# Altium schematic sheet schem.SchDoc
size A; SheetNumber: 1; SheetTotal: 1
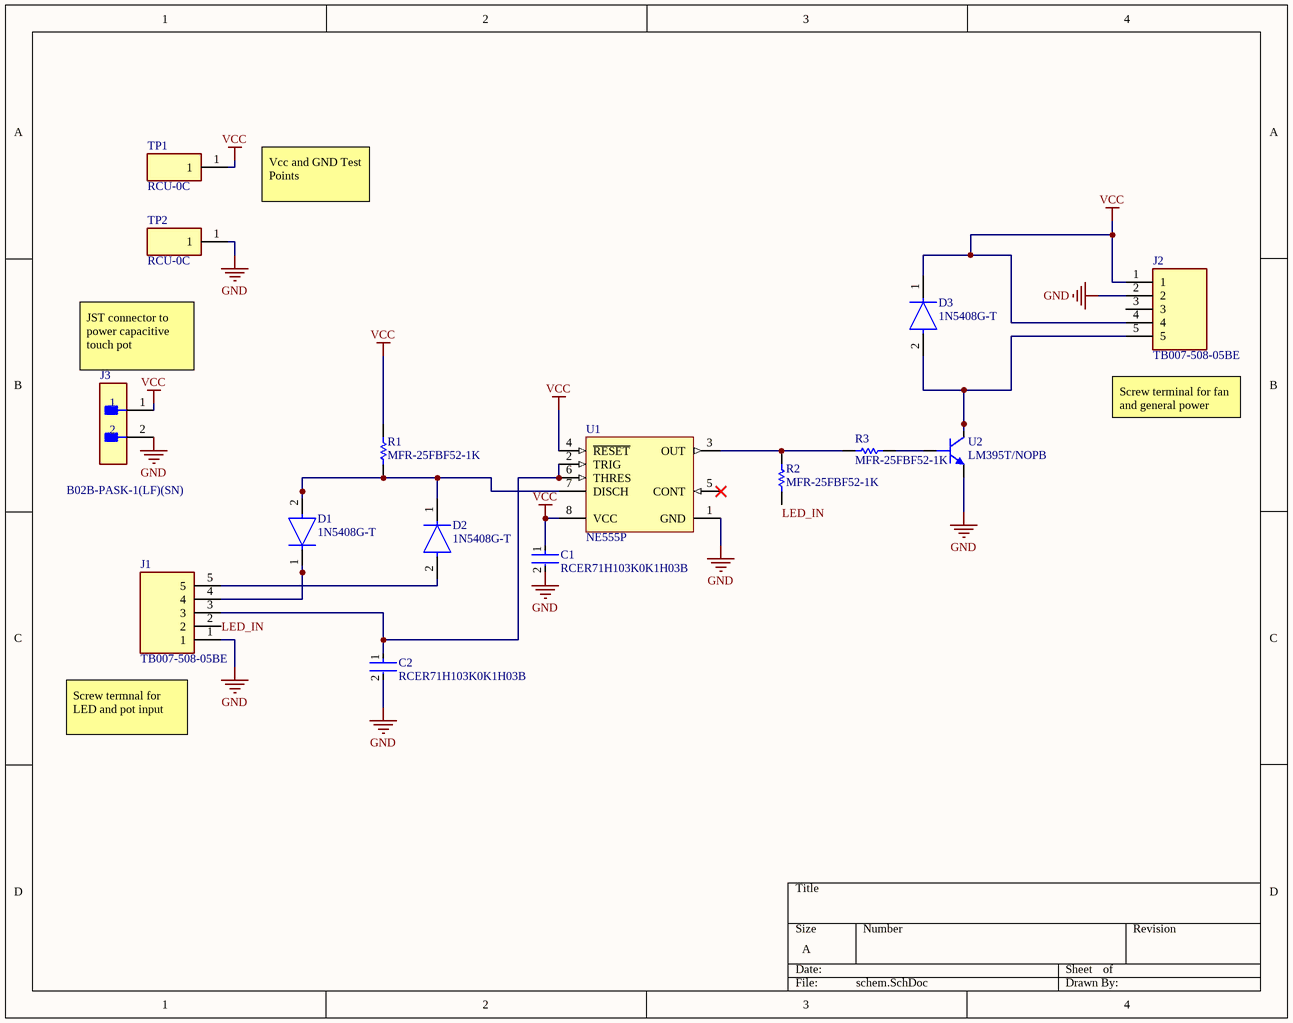
[diagram p0: schem.SchDoc]

## Parts
C1  RCER71H103K0K1H03B  [FP-RCE0K1-MFG]
C2  RCER71H103K0K1H03B  [FP-RCE0K1-MFG]
D1  1N5408G-T  [FP-DO-201AD-MFG]
D2  1N5408G-T  [FP-DO-201AD-MFG]
D3  1N5408G-T  [FP-DO-201AD-MFG]
J1  TB007-508-05BE  [CUI_TB007-508-05BE]
J2  TB007-508-05BE  [CUI_TB007-508-05BE]
J3  B02B-PASK-1(LF)(SN)  [FP-B02B-PASK-1_LF_SN-MFG]
R1  MFR-25FBF52-1K  [RESA60-630X240]
R2  MFR-25FBF52-1K  [RESA60-630X240]
R3  MFR-25FBF52-1K  [RESA60-630X240]
TP1  RCU-0C  [TP+195X110]
TP2  RCU-0C  [TP+195X110]
U1  NE555P  [P0008A]
U2  LM395T/NOPB  [NDE0003A]

## Nets
GND: C1.2 C2.2 J1.1 J2.2 J3.2 TP2.1 U1.1(GND) U2.2(E)
VCC: C1.1 D3.1(C) J2.1 J2.4 J3.1 R1.2 TP1.1 U1.4(~{RESET}) U1.8(VCC)
LED_IN: J1.2 R2.1
NetC2_1: C2.1 J1.3 U1.2(TRIG) U1.6(THRES)
NetD1_1: D1.1(C) J1.4
NetD1_2: D1.2(A) D2.1(C) R1.1 U1.7(DISCH)
NetD2_2: D2.2(A) J1.5
NetD3_2: D3.2(A) J2.5 U2.3(C)
NetR2_2: R2.2 R3.2 U1.3(OUT)
NetR3_1: R3.1 U2.1(B)

Not connected (* = marked no-connect by the designer): J2 3; U1 5(CONT)*

## Notes on the sheet
- Vcc and GND Test Points
- JST connector to power capacitive touch pot
- (near J2) Screw terminal for fan and general power
- (near J1) Screw termnal for LED and pot input

## Library data of the parts
C1 C2 = CMP-06035-044411-1: Cap Ceramic 10nF 50V X7R ±10% Radial 5mm +125°C Automotive Bulk; Lead/Base Style: Formed Leads; Lead Diameter: 0.5mm; Resistor Type: Ceramic; Mount: Through Hole; Capacitance: 10nF; Lead Pitch: 0.197inch; Package Quantity: 500; Dielectric: X7R; Lead Free: Lead Free; Min Operating Temperature: -55°C; Packaging: Bulk; Width: 0.098inch; Length: 0.142inch; Voltage Rating: 50V; Case/Package: Radial; Max Operating Temperature: 125°C; Ratings: AEC-Q200; Height - Seated (Max): 0.138inch; Height: 3.5mm; Termination: Radial; Voltage Rating (DC): 50V; Tolerance: 10%
D1-D3 = CMP-12791-000058-1: DIODE GEN PURP 1KV 3A DO201AD; Element Configuration: Single; Polarity: Standard; Max Reverse Current: 5uA; Reverse Recovery Time: 2us; Max Surge Current: 125A; Forward Voltage: 1.1V; Capacitance: 40pF; Series: -; Average Rectified Current: 3A; Weight: 0.038801oz; Package Quantity: 1200; RoHS Compliant: Yes; Radiation Hardening: No; Mount: Through Hole; Forward Current: 3A; Length: 9.5mm; Min Operating Temperature: -65°C; Height: 5.3mm; Voltage Rating (DC): 1kV; Number of Pins: 2; Lead Free: Lead Free; Reverse Voltage (DC): 1kV; Output Current: 3A; Max Repetitive Reverse Voltage (Vrrm): 1kV; Case/Package: DO-201AD; Peak Non-Repetitive Surge Current: 125A; Current Rating: 3A; Packaging: Tape and Reel; Max Operating Temperature: 150°C; Recovery Time: 2us; Width: 5.3mm; Max Reverse Voltage (DC): 1kV
J3 = CMP-17439-000415-1: CONN HEADER VERT 2POS 2MM; Number of Contacts: 2; Current Rating: 3A; Insulation Resistance: 1GR; Mated Stacking Heights: 14.9mm; Voltage Rating: 250V; Gender: Male; Pitch: 2mm; Orientation: Straight; Contact Finish - Mating: TIN; Mount: Through Hole; Contact Type: Male Pin; Number of Rows: 1; Fastening Type: Ramp; Series: PA; Connector Type: Header; Insulation Color: Natural; Flammability Rating: UL94 V-0; Material: Polybutylene; Contact Shape: Square; Contact Plating: Tin; Insulation Material: PBT; Max Operating Temperature: 85°C; Housing Color: White; Number of Positions: 2; Contact Material: Copper Alloy; Min Operating Temperature: -25°C; Lead Free: Lead Free; Contact Mating Length: 0.126inch; Termination: Solder; Packaging: Bulk; Color: Natural
R1-R3 = CMP-1659-00075-1: Axial Resistor, 1 KOhm, +/- 1%, 250 mW, -55 to 155 degC, 2-Pin THD, RoHS, Bulk; Voltage Rating: 250 V; Resistance: 10 kohm; Power Rating: 250 mW; ComponentLink2Description: Datasheet; RoHSCompliant: true; PackageReference: MFR-25; Case\Package: Axial; Max Operating Temperature: 155 degC; DatasheetVersion: Apr-13; Tolerance: 1%; ComponentLink1URL: http://www.yageo.com/; Length: 0.248 inch; ComponentLink2URL: http://www.yageo.com/documents/recent/Yageo%20LR_MFR_2013.pdf; Packaging: Bulk; Package Quantity: 200; PackageDescription: 2-Pin Axial Lead, Dia 2.4 mm, Body Length 6.3 mm; Min Operating Temperature: -55 degC; ComponentLink1Description: Manufacturer URL
TP1 TP2 = RCU-0C: Natural PC Test Point - - Plating Surface Mount Mounting Type; MF: TE Connectivity AMP Connectors; Price: None; Value: *; Availability: In Stock; Check_prices: https://www.snapeda.com/parts/RCU-0C/TE+Connectivity/view-part/?ref=eda; SnapEDA_Link: https://www.snapeda.com/parts/RCU-0C/TE+Connectivity/view-part/?ref=snap; MP: RCU-0C; Package: None; Purchase-URL: https://pricing.snapeda.com/search/part/RCU-0C/?ref=eda
U1 = CMP-2000-04954-1: Precision Timer, 4.5 to 16 V, 0 to 70 degC, 8-Pin DIP, Pb-Free, Tube; Manufacturer: TexasInstruments; Maximum High Level Output Current: -200mA; Number of Internal Timers: 1; Operating Supply Voltage: 5; Maximum Low Level Output Current: 200mA; Rad Hard: No; Packaging: Rail/Tube; Manufacturer URL: http://www.ti.com/; Package Reference: P8; Package Description: 8-Pin Double In-line Package, Body 9.59 x 6.35 mm, Pitch 2.54 mm; Package URL: http://www.ti.com/lit/ml/mpdi001b/mpdi001b.pdf; Type: Standard; Datasheet URL: http://www.ti.com/general/docs/lit/getliterature.tsp?genericPartNumber=NE555&fileType=pdf; Category: Timer; Package: 8PDIP; Datasheet Version: Rev. I, 09/2014
U2 = CMP-0063-01416-3: Ultra Reliable Power Transistor, 3-pin TO-220, Pb-Free; Manufacturer: Texas Instruments; PowerWise: N; PackageTopMarking: NSUZXYTTE#*LM395T; CompType: MiscPower; RoHS: Y; PackageReference: NDE0003A; ComponentLink1URL: http://www.ti.com/general/docs/lit/getliterature.tsp?genericPartNumber=LM395&fileType=pdf; ComponentLink1Description: Datasheet URL; PinCount: 3; PackageDescription: TO-220, Molded, 3 Lead, Straight
J1 J2 = TB007-508-05BE: Package: None; Price: None; Value: *; MP: TB007-508-05BE; Availability: Unavailable